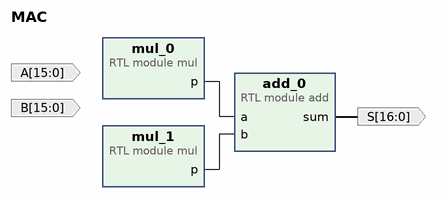
[diagram p0: block diagram of the top level]
# Vivado block design MAC, xc7k70tfbv676-1, Vivado 2022.1.2
create_bd_design MAC

create_bd_port -dir I -from 15 -to 0 A
create_bd_port -dir I -from 15 -to 0 B
create_bd_port -dir O -from 16 -to 0 S

create_bd_cell -type module -reference mul mul_0
create_bd_cell -type module -reference mul mul_1
create_bd_cell -type module -reference add add_0
set_property -dict {CONFIG.WIDTH 16} [get_bd_cells add_0]

# ---- connections ----

connect_bd_net [get_bd_pins add_0/sum] [get_bd_ports S]
connect_bd_net [get_bd_pins mul_0/p] [get_bd_pins add_0/a]
connect_bd_net [get_bd_pins mul_1/p] [get_bd_pins add_0/b]

validate_bd_design
save_bd_design
